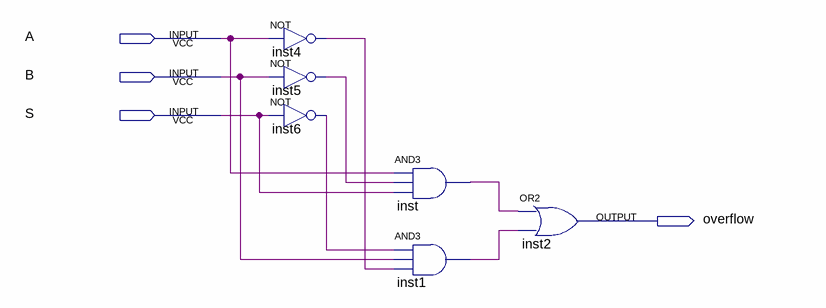
[diagram p0: schematic sheet]
// Quartus schematic Swap_Subtraction_Overflow.bdf as structural Verilog: 6 symbols, 4 pins
module Swap_Subtraction_Overflow (
  input  A,
  input  B,
  input  S,
  output overflow
);

  wire inst1_out, inst4_out, inst5_out, inst6_out, inst_out;

  not inst4 (inst4_out, A);
  not inst5 (inst5_out, B);
  not inst6 (inst6_out, S);
  and inst (inst_out, A, inst5_out, S);
  and inst1 (inst1_out, inst6_out, B, inst4_out);
  or inst2 (overflow, inst_out, inst1_out);
endmodule
